# EAGLE design light sensor basic (EAGLE 9.6.2)
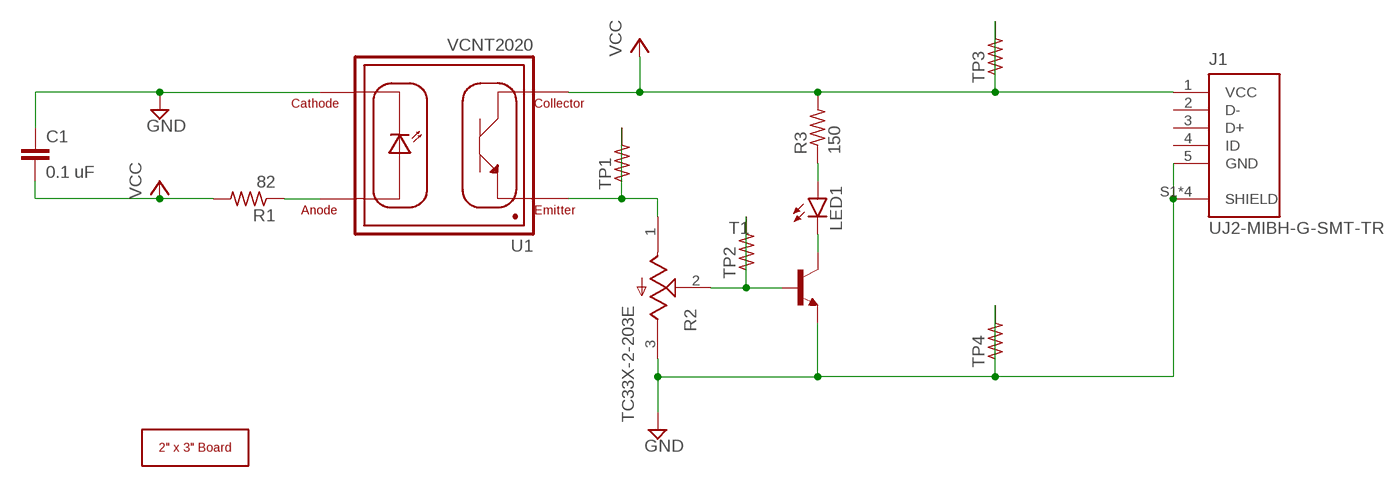
[diagram p0: schematic, sheet 1]

## Parts
C1  0.1 uF  C-EUC1206  [C1206]
J1  UJ2-MIBH-G-SMT-TR  [CUI_UJ2-MIBH-G-SMT-TR]
LED1  LEDSML0805  [SML0805]
R1  82  R-US_R1206  [R1206]
R2  TC33X-2-203E  [TRIM_TC33X-2-203E]
R3  150  R-US_R0805  [R0805]
T1  -NPN-SOT23-EBC  [SOT23-EBC]
TP1  R-US_R1206  [R1206]
TP2  R-US_R1206  [R1206]
TP3  R-US_R1206  [R1206]
TP4  R-US_R1206  [R1206]
U1  VCNT2020  [XDCR_VCNT2020]
U$1  2X3_BOARD_V2  [2X3_BOARD_V2]

## Nets
GND: C1.1 J1.5(GND) J1.S1(SHIELD) J1.S2(SHIELD) J1.S3(SHIELD) J1.S4(SHIELD) R2.3(CW) T1.E TP4.1 TP4.2 U1.4(CATHODE)
N$1: R1.1 U1.3(ANODE)
N$2: R2.1(CCW) TP1.1 TP1.2 U1.1(EMITTER)
N$3: R2.2(W) T1.B TP2.1 TP2.2
N$4: LED1.C T1.C
N$5: LED1.A R3.1
VCC: C1.2 J1.1(VCC) R1.2 R3.2 TP3.1 TP3.2 U1.2(COLLECTOR)
Unconnected: J1.2(D-) J1.3(D+) J1.4(ID)

## Library data of the parts
C1 = rcl:C-EU: CAPACITOR, European symbol; SPICEPREFIX: C
J1 = UJ2-MIBH-G-SMT-TR:UJ2-MIBH-G-SMT-TR: USB micro B type receptacle; MANUFACTURER: CUI; MAXIMUM_PACKAGE_HEIGHT: 2.95 mm; PARTREV: 1.0; STANDARD: Manufacturer Recommendations
LED1 = led:LED: LED OSRAM: - CHIPLED LG R971, LG N971, LY N971, LG Q971, LY Q971, LO R971, LY R971 LH N974, LH R974 LS Q976, LO Q976, LY Q976 LO Q996 - Hyper CHIPLED LW Q18S LB Q993, LB Q99A, LB R99A - SideLED LS A670, LO A670, LY A670, LG A670, LP A670 LB A673, LV A673, LT A673, LW A673 LH A674 LY A675 LS A676, LA A676, LO A676, LY A676, LW A676 LS A679, LY A679, LG A679 - Hyper Micro SIDELED® LS Y876, LA Y876, LO Y876, LY Y876 LT Y87S - SmartLED LW L88C, LW L88S LB L89C, LB L89S, LG L890 LS L89K, LO L89K, LY L89K LS L896, LA L896, LO L896, LY L896 - TOPLED LS T670, LO T670, LY T670, LG T670, LP T670 LSG T670, LSP T670, LSY T670, LOP T670, LYG T670 LG T671, LOG T671, LSG T671 LB T673, LV T673, LT T673, LW T673 LH T674 LS T676, LA T676, LO T676, LY T676, LB T676, LH T676, LSB T676, LW T676 LB T67C, LV T67C, LT T67C, LS T67K, LO T67K, LY T67K, LW E67C LS E67B, LA E67B, LO E67B, LY E67B, LB E67C, LV E67C, LT E67C LW T67C LS T679, LY T679, LG T679 LS T770, LO T770, LY T770, LG T770, LP T770 LB T773, LV T773, LT T773, LW T773 LH T774 LS E675, LA E675, LY E675, LS T675 LS T776, LA T776, LO T776, LY T776, LB T776 LHGB T686 LT T68C, LB T68C - Hyper Mini TOPLED® LB M676 - Mini TOPLED Santana® LG M470 LS M47K, LO M47K, LY M47K Source: http://www.osram.convergy.de LUXEON: - LUMILED® LXK2-PW12-R00, LXK2-PW12-S00, LXK2-PW14-U00, LXK2-PW14-V00 LXK2-PM12-R00, LXK2-PM12-S00, LXK2-PM14-U00 LXK2-PE12-Q00, LXK2-PE12-R00, LXK2-PE12-S00, LXK2-PE14-T00, LXK2-PE14-U00 LXK2-PB12-K00, LXK2-PB12-L00, LXK2-PB12-M00, LXK2-PB14-N00, LXK2-PB14-P00, LXK2-PB14-Q00 LXK2-PR12-L00, LXK2-PR12-M00, LXK2-PR14-Q00, LXK2-PR14-R00 LXK2-PD12-Q00, LXK2-PD12-R00, LXK2-PD12-S00 LXK2-PH12-R00, LXK2-PH12-S00 LXK2-PL12-P00, LXK2-PL12-Q00, LXK2-PL12-R00 Source: www.luxeon.com KINGBRIGHT: KA-3528ASYC Source: www.kingbright.com
R1 R3 TP1-TP4 = rcl:R-US_: RESISTOR, American symbol; SPICEPREFIX: R
R2 = TC33X-2-203E:TC33X-2-203E: Res Trimmer 100K Ohm 25% 1/10W 1(Elec)/1(Mech)Turn (3 X 3.8mm) Foot Print SMD Embossed T/R; CHECK_PRICES: https://www.snapeda.com/parts/TC33X-2-203E/Bourns/view-part/?ref=eda; DESCRIPTION: TRIMMER-3MM OPEN FRAME, 20,000 OHMS | Bourns TC33X-2-203E; DIGIKEY_PART_NUMBER: TC33X-2-203ETR-ND; MF: Bourns; MP: TC33X-2-203E; PACKAGE: 1608 Bourns; SNAPEDA_LINK: https://www.snapeda.com/parts/TC33X-2-203E/Bourns/view-part/?ref=snap
T1 = transistor:*-NPN-: NPN Transistror BF959 corrected 2008.03.06
U1 = VCNT2020:VCNT2020: Reflective Sensor With Ptr Output; CHECK_PRICES: https://www.snapeda.com/parts/VCNT2020/Vishay+Semiconductor+Opto+Division/view-part/?ref=eda; DESCRIPTION: Reflective Optical Sensor 0.02 (0.5mm) 4-SMD Module; DIGIKEY_PART_NUMBER: VCNT2020TR-ND; MF: Vishay; MP: VCNT2020; PACKAGE: None; SNAPEDA_LINK: https://www.snapeda.com/parts/VCNT2020/Vishay+Semiconductor+Opto+Division/view-part/?ref=snap
U$1 = voltera_community_lib:2X3_BOARD

## Board
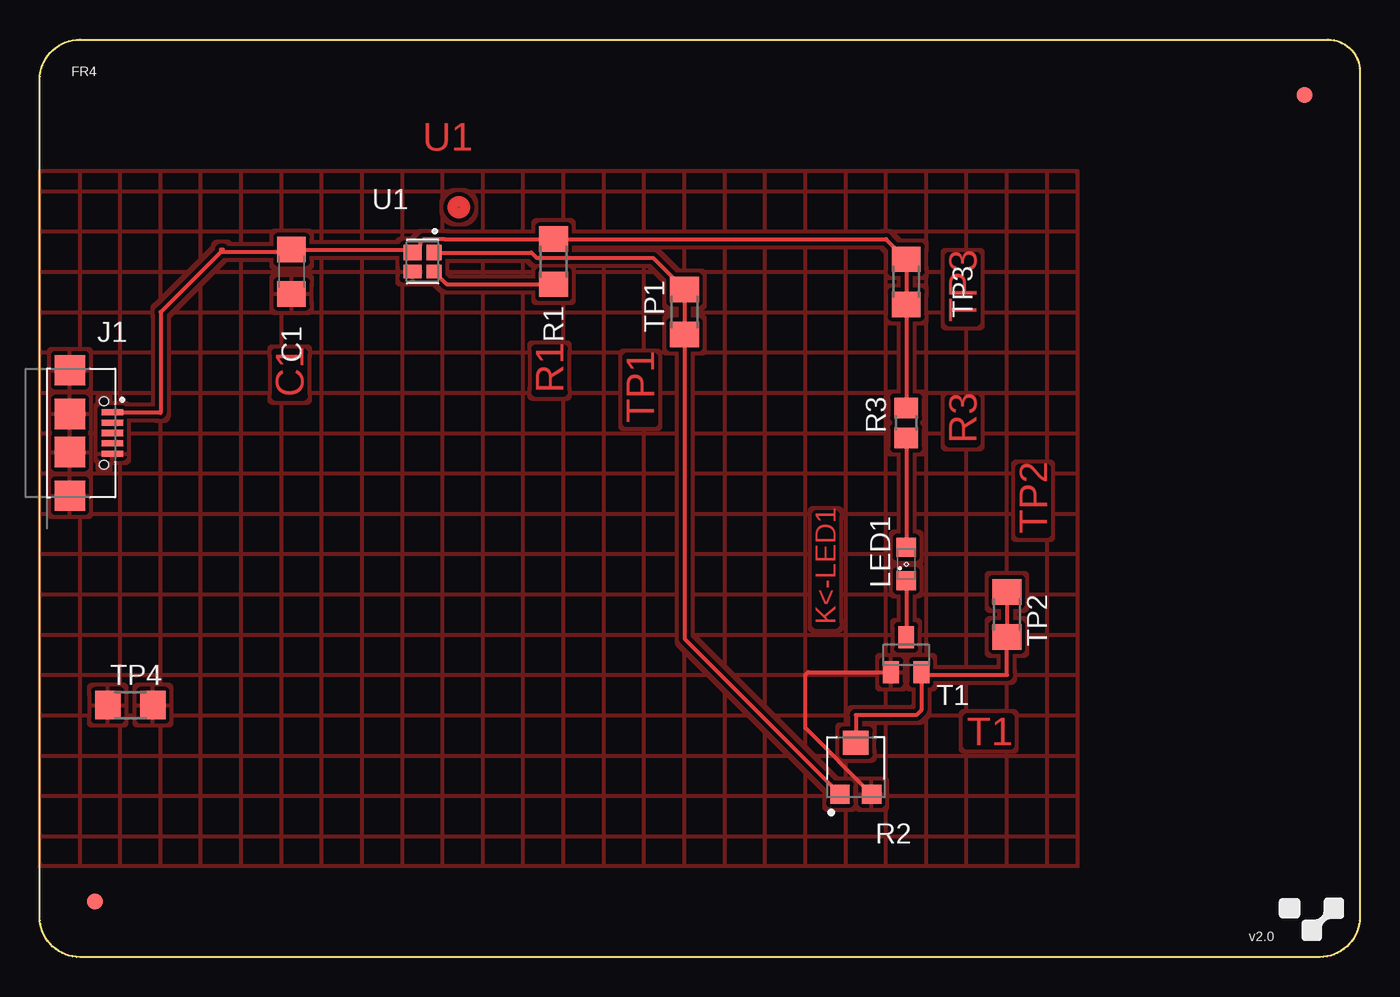
[diagram p1: board, top side]
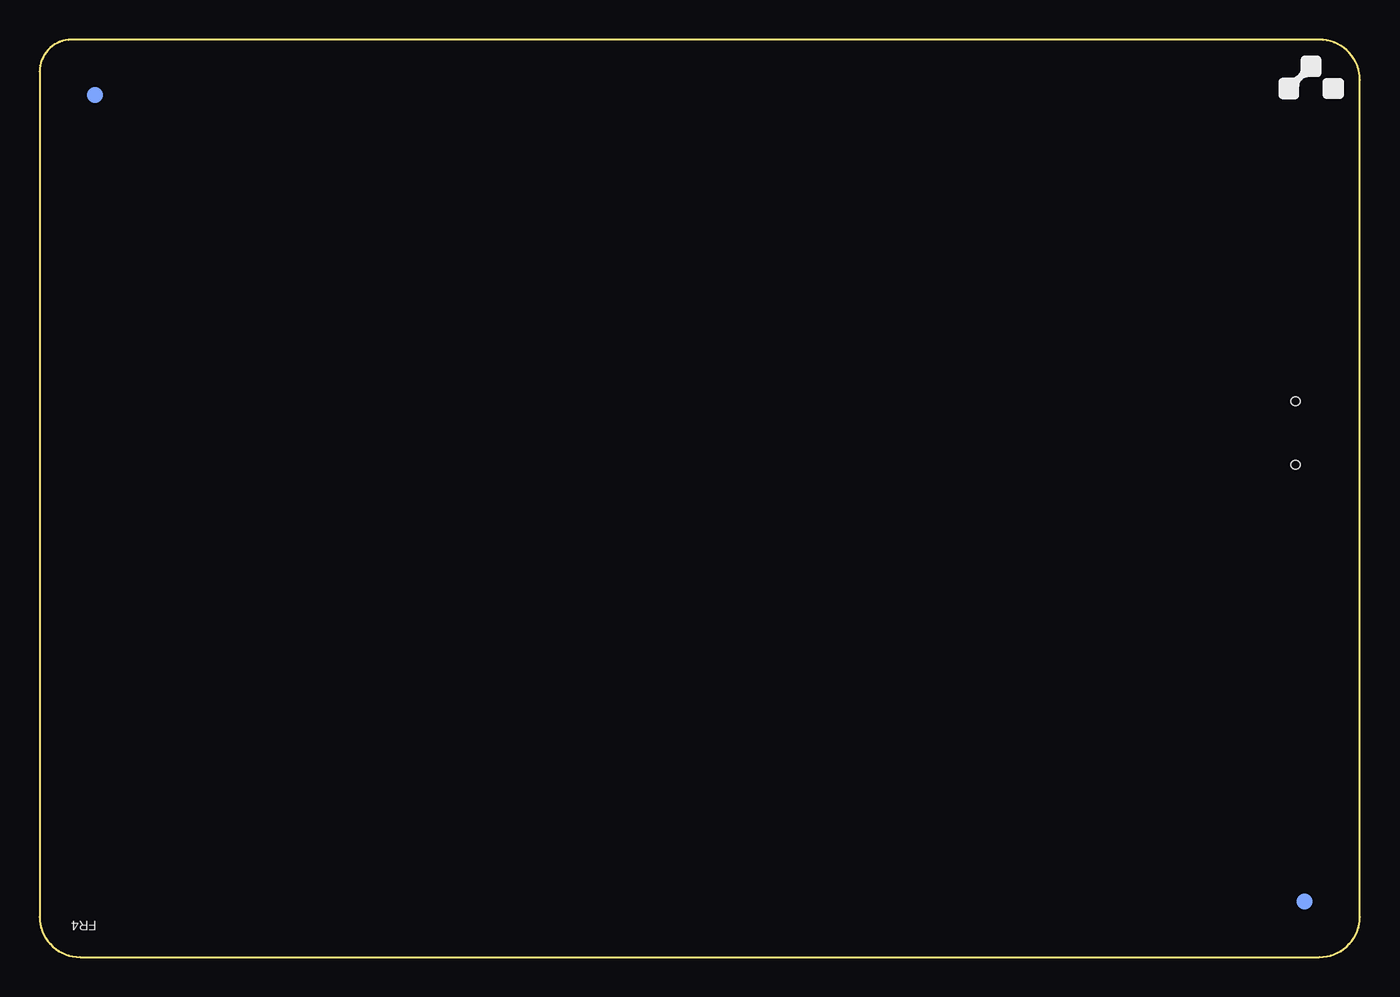
[diagram p2: board, bottom side, seen from below]

Size 83.2 x 57.8 mm. Coordinates in mm from the lower left corner, seen from the top.
Copper layers (1*16): Top 0.035mm / dielectric 1.5mm / Bottom 0.035mm
Design rules "voltera-dru *": minimum track width 10mil, minimum drill 0.4mm, track to track 10mil, track to pad 10mil, pad to pad 10mil, via to via 0.6mm, smd to smd 0mil, copper to edge 0mil, drill to drill 0.8mm, minimum pad ring 0.2mm, minimum via ring 0.2mm, stop-mask expansion 4mil, vias tented up to drill 0mil, thermal gap 10mil

### Footprints (pad centres in the part's own frame; a part is rotated, then mirrored left to right if it is on the bottom)
C1206 = smd 1.6 x 1.8: 1 -1.4,0; 2 1.4,0
CUI_UJ2-MIBH-G-SMT-TR = smd 0.381 x 1.346: 1 -1.3,2.675; 2 -0.65,2.675; 3 0,2.675; 4 0.65,2.675; 5 1.3,2.675 | smd 1.9 x 1.9: S1 -3.95,0; S2 -1.2,0; S3 1.2,0; S4 3.95,0 | hole 0.55: -2,2.15; 2,2.15
SML0805 = smd 1.2 x 1.2: A 1.05,0; C -1.05,0
R1206 = smd 1.6 x 1.803: 1 -1.422,0; 2 1.422,0
TRIM_TC33X-2-203E = smd 1.2 x 1.2: 1 -1.8,1; 3 -1.8,-1 | smd 1.5 x 1.6: 2 1.45,0
R0805 = smd 1.3 x 1.5: 1 -0.95,0; 2 0.95,0
SOT23-EBC = smd 1 x 1.4: B 0.95,-1.1; C 0,1.1; E -0.95,-1.1
XDCR_VCNT2020 = smd 0.97 x 0.95: 1 -0.57,0.725 | smd 0.97 x 1.15: 2 -0.57,-0.625 | smd 0.85 x 0.95: 3 0.63,0.725 | smd 0.85 x 1.15: 4 0.63,-0.625
2X3_BOARD_V2 = smd 1 x 1: P$1 79.7,54.3; P$3 3.5,3.5 | smd 1 x 1 bottom: P$2 79.7,54.3; P$4 3.5,3.5

### Placement (x,y rotation side)
C1  15.88,43.18 90 top
J1  1.91,33.02 270 top
LED1  54.61,24.77 90 top
R1  32.38,43.81 90 top
R2  51.44,12.06 90 top
R3  54.61,33.66 90 top
T1  54.61,19.05 0 top
TP1  40.64,40.64 90 top
TP2  60.96,21.59 270 top
TP3  54.61,42.55 270 top
TP4  5.71,15.88 0 top
U1  24.13,43.81 270 top
U$1  0,0 0 top

### Tracks (layer width: path | path; a pad name or v marks a point on that pad's centre or on a via)
GND
  Top 0.254: R2.3 48.26,14.44 48.26,17.78 48.43,17.95 T1.E
  pour Top (hatched): 0,5.71 0,49.53 65.41,49.53 65.41,48.26 65.41,5.71 64.77,5.71
N$1
  Top 0.254: U1.3 25.65,42.39 R1.1
N$2
  Top 0.254: U1.1 31,44.38 31.33,44.06 38.65,44.06 TP1.2 TP1.1 40.64,20.06 R2.1
N$3
  Top 0.254: 50.8,13.97 51.26,13.52 R2.2 51.44,15.24 55.24,15.24 55.56,15.55 T1.B 55.73,17.78 60.96,17.78 60.96,19.68 TP2.2 TP2.1
N$4
  Top 0.254: LED1.C T1.C
N$5
  Top 0.254: R3.1 LED1.A
VCC
  Top 0.254: 23.31,44.58 23.47,44.42 | 23.47,44.42 U1.2 24,44.88 24,45.03 24.22,45.25 25.49,45.25 25.5,45.24 R1.2 53.34,45.24 TP3.1 TP3.2 R3.2 | J1.1 4.61,34.29 7.62,34.29 7.62,40.64 11.43,44.45 | 11.43,44.45 11.56,44.58 11.43,44.58 11.43,44.45 | 11.43,44.45 15.88,44.45 C1.2 23.47,44.58 23.47,44.42
(copper drawn outside any net)
  shapes: Top circle x3

### Text on the board
Top: U1 | TP3 | R1 | C1 | TP1 | R3 | TP2 | K<-LED1 | T1